# Altium project ArcadESP v1.PrjPcb
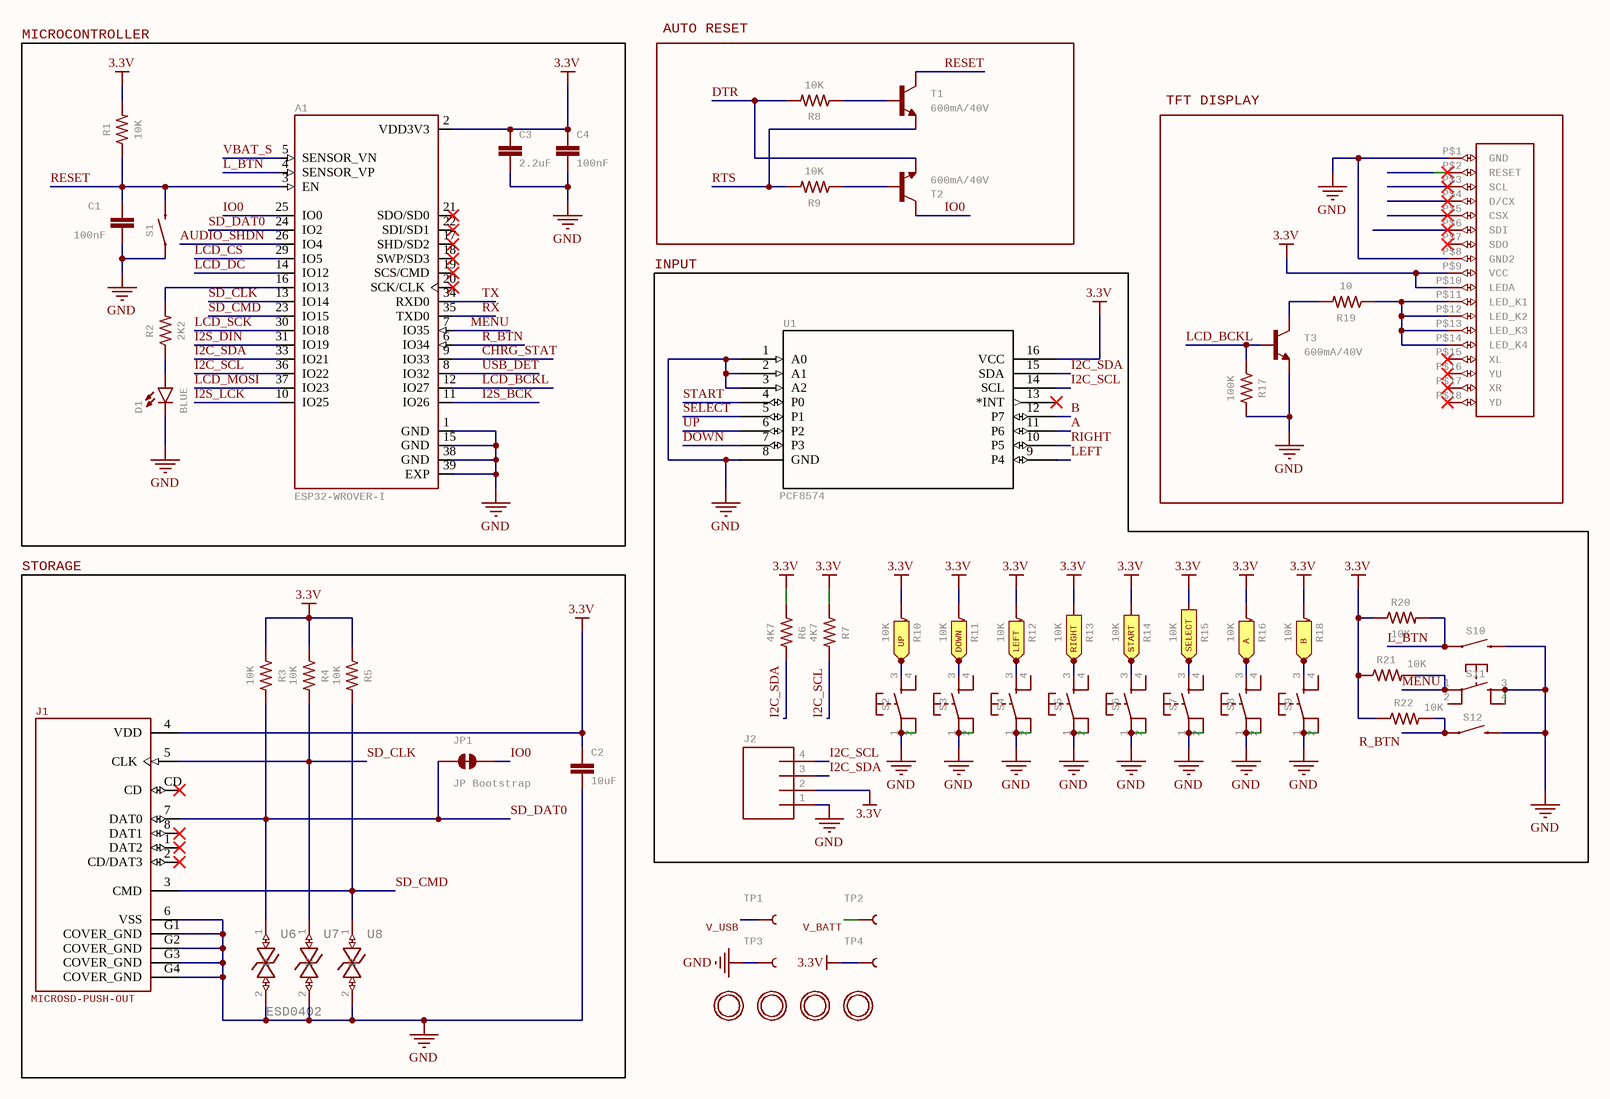
[diagram p0: Schematic_1.SchDoc]
2 sheets, 115 parts. Net scope: flat (ports and power ports of the same name join across sheets).
Board file: ArcadESP.PcbDoc
Sheets:
  Schematic_1.SchDoc
  Schematic_2.SchDoc

## Sheet Schematic_1.SchDoc
size 381 x 241 mm; SheetNumber: 1; SheetTotal: 2

### Parts
A1  ESP32-WROVER-I  [XCVR_ESP32-WROVER-I]
C1  100nF  [0805]
C2  10uF  [0805]
C3  2.2uF  [0805]
C4  100nF  [0805]
D1  BLUE  [LED-0603]
H1  (no value)  [MICROBUILDER_MOUNTINGHOLE_3.0_PLATEDTHIN]
H2  (no value)  [MICROBUILDER_MOUNTINGHOLE_3.0_PLATEDTHIN]
H3  (no value)  [MICROBUILDER_MOUNTINGHOLE_3.0_PLATEDTHIN]
H4  (no value)  [MICROBUILDER_MOUNTINGHOLE_3.0_PLATEDTHIN]
J1  MICROSD-PUSH-OUT  [MICROSD-PUSH-OUT]
J2  (no value)  [1X04_1MM_RA]
JP1  JP Bootstrap  [SMT-JUMPER_2_NC_TRACE_NO-SILK]
LCD?  ILI9341-2.4_LCD1  [ILI9341-2-4]  (value not drawn)
R1  10K  [0805]
R2  2K2  [0805]
R3  10K  [0805]
R4  10K  [0805]
R5  10K  [0805]
R6  4K7  [0805]
R7  4K7  [0805]
R8  10K  [0805]
R9  10K  [0805]
R10  10K  [0805]
R11  10K  [0805]
R12  10K  [0805]
R13  10K  [0805]
R14  10K  [0805]
R15  10K  [0805]
R16  10K  [0805]
R17  100K  [0805]
R18  10K  [0805]
R19  10  [0805]
R20  10K  [0805]
R21  10K  [0805]
R22  10K  [0805]
S1  Momentary Switch (Pushbutton) - SPST    Normally-open (NO) SPST momentary switches (buttons, pushbuttons). Variants  PTH-12MM - 12mm square, through-hole  Momentary Pushbutton Switch - 12mm Square (COM-09190)     PTH-6.0MM, PTH-6.0MM-KIT - 6.0mm square, through-hole  Mini Pushbutton Switch (COM-00097)  KIT package intended for soldering kit's - only one side of pads' copper is exposed.     PTH-RIGHT-ANGLE-KIT - Right-angle, through-hole  Right Angle Tactile Button - Used on SparkFun BigTime Watch Kit     SMD-12MM - 12mm square, surface-mount  Tactile Button - SMD (12mm) (COM-12993)  Used on SparkFun PicoBoard     SMD-4.5MM - 4.5mm Square Trackball Switch  Used on SparkFun Blackberry Trackballer Breakout     SMD-4.6MMX2.8MM -  4.60mm x 2.80mm, surface mount  Used on SparkFun SAMD21 Mini Breakout     SMD-5.2MM, SMD-5.2-REDUNDANT - 5.2mm square, surface-mount  Mini Pushbutton Switch - SMD (COM-08720)  Used on Arduino Pro Mini  REDUNDANT package connects both switch circuits together     SMD-6.0X3.5MM - 6.0 x 3.5mm, surface mount  Momentary Reset Switch SMD (COM-08229)     SMD-6.2MM-TALL - 6.2mm square, surface mount  Tactile Button - SMD (6mm)  Used on SparkFun Digital Sandbox     SMD-RIGHT-ANGLE - Right-angle, surface mount  Used on SparkFun Block for IntelÂ® Edison - Arduino  [TACTILE_SWITCH_SMD_5-2MM]  (value not drawn)
S2  MOMENTARY-SWITCH-SPST-2  [TACTILE_SWITCH_SMD_5-2MM]  (value not drawn)
S3  MOMENTARY-SWITCH-SPST-2  [TACTILE_SWITCH_SMD_5-2MM]  (value not drawn)
S4  MOMENTARY-SWITCH-SPST-2  [TACTILE_SWITCH_SMD_5-2MM]  (value not drawn)
S5  MOMENTARY-SWITCH-SPST-2  [TACTILE_SWITCH_SMD_5-2MM]  (value not drawn)
S6  MOMENTARY-SWITCH-SPST-2  [TACTILE_SWITCH_SMD_5-2MM]  (value not drawn)
S7  MOMENTARY-SWITCH-SPST-2  [TACTILE_SWITCH_SMD_5-2MM]  (value not drawn)
S8  MOMENTARY-SWITCH-SPST-2  [TACTILE_SWITCH_SMD_5-2MM]  (value not drawn)
S9  MOMENTARY-SWITCH-SPST-2  [TACTILE_SWITCH_SMD_5-2MM]  (value not drawn)
S10  Momentary Switch (Pushbutton) - SPST    Normally-open (NO) SPST momentary switches (buttons, pushbuttons). Variants  PTH-12MM - 12mm square, through-hole  Momentary Pushbutton Switch - 12mm Square (COM-09190)     PTH-6.0MM, PTH-6.0MM-KIT - 6.0mm square, through-hole  Mini Pushbutton Switch (COM-00097)  KIT package intended for soldering kit's - only one side of pads' copper is exposed.     PTH-RIGHT-ANGLE-KIT - Right-angle, through-hole  Right Angle Tactile Button - Used on SparkFun BigTime Watch Kit     SMD-12MM - 12mm square, surface-mount  Tactile Button - SMD (12mm) (COM-12993)  Used on SparkFun PicoBoard     SMD-4.5MM - 4.5mm Square Trackball Switch  Used on SparkFun Blackberry Trackballer Breakout     SMD-4.6MMX2.8MM -  4.60mm x 2.80mm, surface mount  Used on SparkFun SAMD21 Mini Breakout     SMD-5.2MM, SMD-5.2-REDUNDANT - 5.2mm square, surface-mount  Mini Pushbutton Switch - SMD (COM-08720)  Used on Arduino Pro Mini  REDUNDANT package connects both switch circuits together     SMD-6.0X3.5MM - 6.0 x 3.5mm, surface mount  Momentary Reset Switch SMD (COM-08229)     SMD-6.2MM-TALL - 6.2mm square, surface mount  Tactile Button - SMD (6mm)  Used on SparkFun Digital Sandbox     SMD-RIGHT-ANGLE - Right-angle, surface mount  Used on SparkFun Block for IntelÂ® Edison - Arduino  [TACTILE_SWITCH_PTH_RIGHT_ANGLE_KIT]  (value not drawn)
S11  MOMENTARY-SWITCH-SPST-2  [TACTILE_SWITCH_SMD_5-2MM]  (value not drawn)
S12  Momentary Switch (Pushbutton) - SPST    Normally-open (NO) SPST momentary switches (buttons, pushbuttons). Variants  PTH-12MM - 12mm square, through-hole  Momentary Pushbutton Switch - 12mm Square (COM-09190)     PTH-6.0MM, PTH-6.0MM-KIT - 6.0mm square, through-hole  Mini Pushbutton Switch (COM-00097)  KIT package intended for soldering kit's - only one side of pads' copper is exposed.     PTH-RIGHT-ANGLE-KIT - Right-angle, through-hole  Right Angle Tactile Button - Used on SparkFun BigTime Watch Kit     SMD-12MM - 12mm square, surface-mount  Tactile Button - SMD (12mm) (COM-12993)  Used on SparkFun PicoBoard     SMD-4.5MM - 4.5mm Square Trackball Switch  Used on SparkFun Blackberry Trackballer Breakout     SMD-4.6MMX2.8MM -  4.60mm x 2.80mm, surface mount  Used on SparkFun SAMD21 Mini Breakout     SMD-5.2MM, SMD-5.2-REDUNDANT - 5.2mm square, surface-mount  Mini Pushbutton Switch - SMD (COM-08720)  Used on Arduino Pro Mini  REDUNDANT package connects both switch circuits together     SMD-6.0X3.5MM - 6.0 x 3.5mm, surface mount  Momentary Reset Switch SMD (COM-08229)     SMD-6.2MM-TALL - 6.2mm square, surface mount  Tactile Button - SMD (6mm)  Used on SparkFun Digital Sandbox     SMD-RIGHT-ANGLE - Right-angle, surface mount  Used on SparkFun Block for IntelÂ® Edison - Arduino  [TACTILE_SWITCH_PTH_RIGHT_ANGLE_KIT]  (value not drawn)
T1  600mA/40V  [SOT23-3]
T2  600mA/40V  [SOT23-3]
T3  600mA/40V  [SOT23-3]
TP1  (no value)  [PAD.03X.03]
TP2  (no value)  [PAD.03X.03]
TP3  (no value)  [PAD.03X.03]
TP4  (no value)  [PAD.03X.03]
U1  PCF8574  [SO16]
U6  ESD0402  [ESD0402]
U7  ESD0402  [ESD0402]  (value not drawn)
U8  ESD0402  [ESD0402]  (value not drawn)

### Blocks framed on the sheet
MICROCONTROLLER: A1 C1 C3 C4 D1 R1 R2 S1
AUTO RESET: R8 R9 T1 T2
TFT DISPLAY: LCD? R17 R19 T3
INPUT: J2 R6 R7 R10-R16 R18 R20-R22 S2-S12 U1
STORAGE: C2 J1 JP1 R3-R5 U6-U8

### Ports
A (in), B (in), DOWN (in), LEFT (in), RIGHT (in), SELECT (in), START (in), UP (in)

### Nets
3.3V: A1.2(VDD3V3) C2.1 C3.1 C4.1 J1.4(VDD) J2.2 LCD?.P$9(VCC) LCD?.P$10(LEDA) R1.2 R3.1 R4.1 R5.1 R6.1 R7.1 R10.1 R11.1 R12.1 R13.1 R14.1 R15.1 R16.1 R18.1 R20.1 R21.1 R22.1 TP4.P$1 U1.16(VCC)
GND: A1.1(GND) A1.15(GND) A1.38(GND) A1.39(EXP) C1.2 C2.2 C3.2 C4.2 D1.C J1.6(VSS) J1.G1(COVER_GND) J1.G2(COVER_GND) J1.G3(COVER_GND) J1.G4(COVER_GND) J2.1 LCD?.P$1(GND) LCD?.P$8(GND2) R17.2 S1.1 S2.1 S2.2 S3.1 S3.2 S4.1 S4.2 S5.1 S5.2 S6.1 S6.2 S7.1 S7.2 S8.1 S8.2 S9.1 S9.2 S10.2 S11.3 S11.4 S12.2 T3.2(E) TP3.P$1 U1.1(A0) U1.2(A1) U1.3(A2) U1.8(GND) U6.2 U7.2 U8.2  [project net AUDIO_SHDN]
A: U1.11(P6)
AUDIO_SHDN: A1.26(IO4)
B: U1.12(P7)
CHRG_STAT: A1.9(IO33)
DOWN: U1.7(P3)
DTR: R8.2 T2.2(E)
I2C_SCL: A1.36(IO22) J2.4 R7.2 U1.14(SCL)
I2C_SDA: A1.33(IO21) J2.3 R6.2 U1.15(SDA)
I2S_BCK: A1.11(IO26)
I2S_DIN: A1.31(IO19)
I2S_LCK: A1.10(IO25)
IO0: A1.25(IO0) JP1.2 T2.3(C)
L_BTN: A1.4(SENSOR_VP) R20.2 S10.1
LCD_BCKL: A1.12(IO27) R17.1 T3.1(B)
LCD_CS: A1.29(IO5)
LCD_DC: A1.14(IO12)
LCD_MOSI: A1.37(IO23)
LCD_SCK: A1.30(IO18)
LEFT: U1.9(P4)
MENU: A1.7(IO35) R21.2 S11.1
R_BTN: A1.6(IO34) R22.2 S12.1
RESET: A1.3(EN) C1.1 R1.1 S1.3 T1.3(C)
RIGHT: U1.10(P5)
RTS: R9.2 T1.2(E)
RX: A1.35(TXD0)
SD_CLK: A1.13(IO14) J1.5(CLK) R4.2 U7.1
SD_CMD: A1.23(IO15) J1.3(CMD) R5.2 U8.1
SD_DAT0: A1.24(IO2) J1.7(DAT0) JP1.1 R3.2 U6.1
SELECT: U1.5(P1)
START: U1.4(P0)
TX: A1.34(RXD0)
UP: U1.6(P2)
USB_DET: A1.8(IO32)
V_BATT: TP2.P$1
V_USB: TP1.P$1
VBAT_S: A1.5(SENSOR_VN)
NetA1_16: A1.16(IO13) R2.2
NetD1_A: D1.A R2.1
NetLCD?_P$11: LCD?.P$11(LED_K1) LCD?.P$12(LED_K2) LCD?.P$13(LED_K3) LCD?.P$14(LED_K4) R19.1
NetR8_1: R8.1 T1.1(B)
NetR9_1: R9.1 T2.1(B)
NetR10_2: R10.2 S2.3 ; port UP
NetR11_2: R11.2 S3.3 ; port DOWN
NetR12_2: R12.2 S4.3 ; port LEFT
NetR13_2: R13.2 S5.3 ; port RIGHT
NetR14_2: R14.2 S6.3 ; port START
NetR15_2: R15.2 S7.3 ; port SELECT
NetR16_2: R16.2 S8.3 ; port A
NetR18_2: R18.2 S9.3 ; port B
NetR19_2: R19.2 T3.3(C)

Not connected (* = marked no-connect by the designer): A1 17(SHD/SD2)* 18(SWP/SD3)* 19(SCS/CMD)* 20(SCK/CLK)* 21(SDO/SD0)* 22(SDI/SD1)*; J1 1(DAT2)* 2(CD/DAT3)* 8(DAT1)* CD*; LCD? P$2(RESET)* P$3(SCL)* P$4(D/CX)* P$5(CSX)* P$6(SDI)* P$7(SDO)* P$15(XL)* P$16(YU)* P$17(XR)* P$18(YD)*; S2 4; S3 4; S4 4; S5 4; S6 4; S7 4; S8 4; S9 4; S11 2; U1 13(*INT)*

### Library data of the parts
A1 = ESP32-WROVER-I_A1: Module: combo; GPIO, I2C x2, I2S x2, SDIO, SPI x3, UART x3; U.FL; GateName_1: G$1; MF: Espressif Systems; SymbolName_1: ESP32-WROVER-I; LibraryName: ESP32-WROVER-I; DeviceSetName: ESP32-WROVER-I; Package: XCVR_ESP32-WROVER-I; AVAILABILITY: Unavailable; MP: ESP32-WROVER-I; PACKAGE: Module Espressif Systems; PRICE: None
C1 C2 C4 = 2.2UF-0805-25V-(+80/-20%): GateName_1: G$1; SymbolName_1: CAP; DeviceSetName: 2.2UF; PROD_ID: CAP-10009; DeviceName: -0805-25V-(+80/-20%); LibraryName: SparkFun-Capacitors; Package: 0805
C3 = 2.2UF-0805-25V-(+80/-20%): GateName_1: G$1; SymbolName_1: CAP; PROD_ID: CAP-10009; DeviceName: -0805-25V-(+80/-20%); LibraryName: SparkFun-Capacitors; DeviceSetName: 2.2UF; Package: 0805
D1 = LED-BLUE0603: GateName_1: G$1; SymbolName_1: LED; DeviceName: 0603; PROD_ID: DIO-09911; LibraryName: SparkFun-LED; DeviceSetName: LED-BLUE; Package: LED-0603
H1-H4 = Mounting Hole_H1, H2, H3, H4: MICROBUILDER_MOUNTINGHOLE3.0THIN; GateName_1: G$1; BOM: EXCLUDE; SymbolName_1: MICROBUILDER_MOUNTINGHOLE; DeviceName: 3.0THIN; LibraryName: Adafruit UDA1334 I2S DAC; DeviceSetName: MICROBUILDER_MOUNTINGHOLE; Package: MICROBUILDER_MOUNTINGHOLE_3.0_PLATEDTHIN
J1 = MICROSD-PUSH-OUT_J1: T-Flash Push-Out Micro SD Card Reader 14.75mm x 14.5mm SMD with external pins; GateName_1: G$1; SymbolName_1: MICROSD; LibraryName: microsd; DeviceSetName: MICROSD-PUSH-OUT; Package: MICROSD-PUSH-OUT
J2 = QWIIC_CONNECTORJS-1MM_J2: QWIIC_CONNECTORJS-1MM; GateName_1: G$1; SymbolName_1: I2C_STANDARD; DeviceName: JS-1MM; PROD_ID: CONN-13694; LibraryName: SparkFun-Connectors; DeviceSetName: QWIIC_CONNECTOR; Package: 1X04_1MM_RA
JP1 = JP Bootstrap_JP1: JUMPER-SMT_2_NC_TRACE_NO-SILK; GateName_1: G$1; SymbolName_1: SMT-JUMPER_2_NC_TRACE; DeviceName: _NO-SILK; LibraryName: SparkFun-Jumpers; DeviceSetName: JUMPER-SMT_2_NC_TRACE; Package: SMT-JUMPER_2_NC_TRACE_NO-SILK
LCD? = ILI9341-2.4_LCD1: GateName_1: G$1; SymbolName_1: ILI9341-2.4; LibraryName: TFTDisplays; DeviceSetName: ILI9341-2.4; Package: ILI9341-2.4
R1-R22 = 0.22OHM-0805-1/4W-1%: GateName_1: G$1; SymbolName_1: RESISTOR; PROD_ID: RES-09883; DeviceName: -0805-1/4W-1%; LibraryName: SparkFun-Resistors; DeviceSetName: 0.22OHM; Package: 0805
S1 = MOMENTARY-SWITCH-SPST-SMD-5.2MM: GateName_1: G$1; SymbolName_1: SWITCH-MOMENTARY-2; PROD_ID: COMP-12265; DeviceName: -SMD-5.2MM; LibraryName: SparkFun-Switches; DeviceSetName: MOMENTARY-SWITCH-SPST; Package: TACTILE_SWITCH_SMD_5.2MM; SF_SKU: COM-12993
S2-S9 S11 = MOMENTARY-SWITCH-SPST-2: MOMENTARY-SWITCH-SPST-2-SMD-5.2MM, S2, S3, S4, S5, S6, S7, S8, S9, S11; GateName_1: G$1; SymbolName_1: SWITCH-MOMENTARY; PROD_ID: SWCH-08247; SF_SKU: COM-08720; DeviceName: -SMD-5.2MM; LibraryName: SparkFun-Switches; DeviceSetName: MOMENTARY-SWITCH-SPST-2; Package: TACTILE_SWITCH_SMD_5.2MM
S10 S12 = MOMENTARY-SWITCH-SPST-PTH-RIGHT-ANGLE-KIT_L: MOMENTARY-SWITCH-SPST-PTH-RIGHT-ANGLE-KIT; GateName_1: G$1; SymbolName_1: SWITCH-MOMENTARY-2; PROD_ID: SWCH-09213; SF_SKU: COM-10791; DeviceName: -PTH-RIGHT-ANGLE-KIT; LibraryName: SparkFun-Switches; DeviceSetName: MOMENTARY-SWITCH-SPST; Package: TACTILE_SWITCH_PTH_RIGHT_ANGLE_KIT
T1-T3 = TRANS_NPN-MMBT2222AL: GateName_1: G$1; SymbolName_1: NPN; PROD_ID: TRANS-08049; DeviceName: -MMBT2222AL; LibraryName: SparkFun-DiscreteSemi; DeviceSetName: TRANS_NPN; Package: SOT23-3
TP1-TP4 = TEST-POINT3_TP1, TP2, TP3, TP4: PAD.03X.03; GateName_1: G$1; DeviceName: 3; SymbolName_1: TEST-POINT; LibraryName: SparkFun-Connectors; DeviceSetName: TEST-POINT; Package: PAD.03X.03
U1 = PCF8574_U1: 8 100kHz I2C SO-16-300mil I/O Expanders ROHS; GateName_1: G$1; MF: Texas Instruments; SymbolName_1: PCF8574; LibraryName: PCF8574; DeviceSetName: PCF8574; Package: SO16; AVAILABILITY: Unavailable; MP: PCF8574; PACKAGE: SOIC-16 Texas Instruments; PRICE: None
U6-U8 = ESD0402_U6, U7, U8: GateName_1: G$1; SymbolName_1: ESDM3032MXT5G; LibraryName: ESDM3032MXT5G; DeviceSetName: ESD0402; Package: ESD0402

## Sheet Schematic_2.SchDoc
size 381 x 241 mm; SheetNumber: 2; SheetTotal: 2
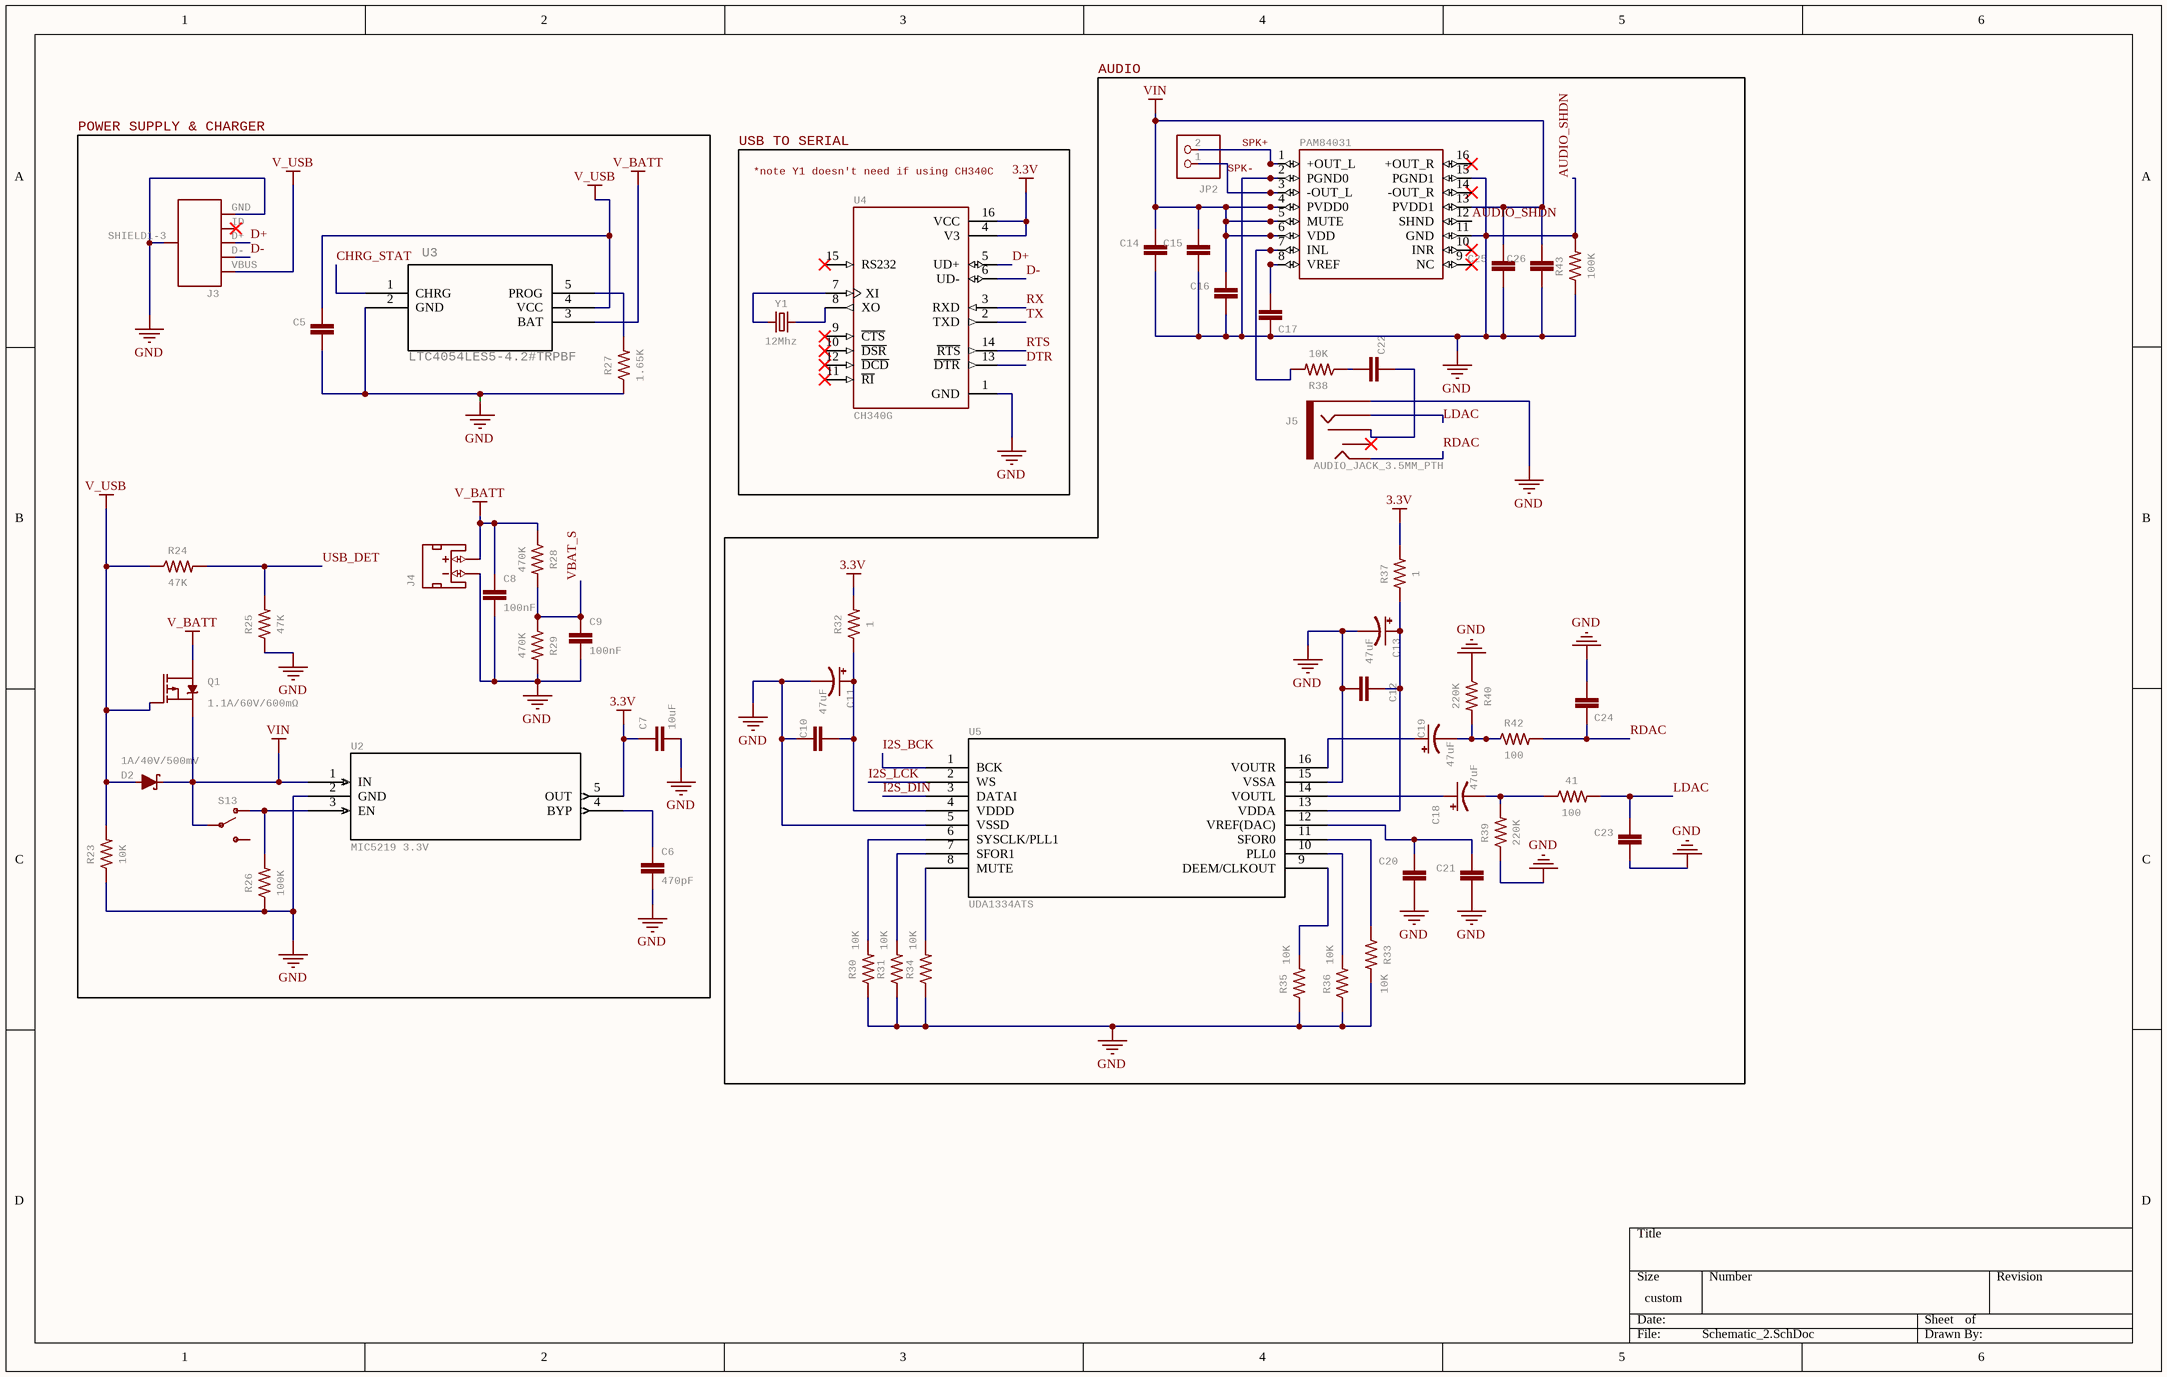
[diagram p1: Schematic_2.SchDoc]

### Parts
41  100  [0805 RESISTOR]
C5  (no value)  [0805]
C6  470pF  [0805]
C7  10uF  [0805]
C8  100nF  [0805]
C9  100nF  [0805]
C10  (no value)  [0805]
C11  47uF  [EIA3528]
C12  (no value)  [0805]
C13  47uF  [EIA3528]
C14  (no value)  [0805]
C15  (no value)  [0805]
C16  (no value)  [0805]
C17  (no value)  [0805]
C18  47uF  [EIA3528]
C19  47uF  [EIA3528]
C20  (no value)  [0805]
C21  (no value)  [0805]
C22  (no value)  [0805]
C23  (no value)  [0805]
C24  (no value)  [0805]
C25  (no value)  [0805]
C26  (no value)  [0805]
D2  1A/40V/500mV  [SMA-DIODE]
J3  (no value)  [USB-B-MICRO-SMD]
J4  (no value)  [JST-2-SMD]
J5  AUDIO_JACK_3.5MM_PTH  [AUDIO-JACK]
JP2  (no value)  [1X02M]
PAM84031  PAM8403  [SOP-16]  (value not drawn)
Q1  1.1A/60V/600mΩ  [SOT23-3]
R23  10K  [0805]
R24  47K  [0805]
R25  47K  [0805]
R26  100K  [0805]
R27  1.65K  [0805]
R28  470K  [0805]
R29  470K  [0805]
R30  10K  [0805]
R31  10K  [0805]
R32  1  [0805]
R33  10K  [0805]
R34  10K  [0805]
R35  10K  [0805]
R36  10K  [0805]
R37  1  [0805]
R38  10K  [0805]
R39  220K  [0805]
R40  220K  [0805]
R42  100  [0805]
R43  100K  [0805]
S13  (no value)  [SWITCH_SPST_SMD_A]
U2  MIC5219 3.3V  [SOT23-5]
U3  LTC4054LES5-4.2#TRPBF  [SOT95P280X100-5N]
U4  CH340G  [SO016]
U5  UDA1334ATS  [MICROBUILDER_SSOP16_4.4MM]
Y1  12Mhz  [CRYSTAL-SMD-5X3.2-4PAD]

### Blocks framed on the sheet
POWER SUPPLY & CHARGER: C5-C9 D2 J3 J4 Q1 R23-R29 S13 U2 U3
AUDIO: 41 C10-C26 J5 JP2 PAM84031 R30-R40 R42 R43 U5
USB TO SERIAL: U4 Y1

### Nets
3.3V: C7.1 R32.2 R37.2 U2.5(OUT) U4.4(V3) U4.16(VCC)
AUDIO_SHDN: C5.1 C6.2 C7.2 C8.2 C9.2 C10.1 C11.C(-) C12.1 C13.C(-) C14.1 C15.1 C16.1 C17.1 C20.1 C21.1 C23.1 C24.1 C25.1 C26.1 J3.GND J3.SHIELD1-3(SHIELD) J4.1(-) J5.SLEEVE PAM84031.2(PGND0) PAM84031.11(GND) PAM84031.12(SHND) PAM84031.15(PGND1) R23.1 R25.1 R26.1 R27.1 R29.2 R30.1 R31.1 R33.1 R34.1 R35.1 R36.1 R39.1 R40.1 R43.1 R43.2 U2.2(GND) U3.2(GND) U4.1(GND) U5.5(VSSD) U5.15(VSSA)  [also labelled GND]
V_BATT: C8.1 J4.2(+) Q1.3(D) R28.1 U3.3(BAT)
V_USB: C5.2 D2.A J3.VBUS Q1.1(G) R23.2 R24.1 U3.4(VCC)
VIN: C14.2 C15.2 C16.2 C25.2 C26.2 D2.C PAM84031.4(PVDD0) PAM84031.5(MUTE) PAM84031.6(VDD) PAM84031.13(PVDD1) Q1.2(S) S13.2(P) U2.1(IN)
CHRG_STAT: U3.1(CHRG)
D+: J3.D+ U4.5(UD+)
D-: J3.D- U4.6(UD-)
DTR: U4.13(~{DTR})
I2S_BCK: U5.1(BCK)
I2S_DIN: U5.3(DATAI)
I2S_LCK: U5.2(WS)
LDAC: 41.2 C23.2 J5.RING
RDAC: C24.2 J5.TIP R42.2
RTS: U4.14(~{RTS})
RX: U4.3(RXD)
SPK+: JP2.2 PAM84031.1(+OUT_L)
SPK-: JP2.1 PAM84031.3(-OUT_L)
TX: U4.2(TXD)
USB_DET: R24.2 R25.2
VBAT_S: C9.1 R28.2 R29.1
Net41_1: 41.1 C18.C(-) R39.2
NetC6_1: C6.1 U2.4(BYP)
NetC10_2: C10.2 C11.A(+) R32.1 U5.4(VDDD)
NetC12_2: C12.2 C13.A(+) R37.1 U5.13(VDDA)
NetC17_2: C17.2 PAM84031.8(VREF)
NetC18_A: C18.A(+) U5.14(VOUTL)
NetC19_A: C19.A(+) U5.16(VOUTR)
NetC19_C: C19.C(-) R40.2 R42.1
NetC20_2: C20.2 C21.2 U5.12(VREF(DAC))
NetC22_1: C22.1 R38.1
NetC22_2: C22.2 J5.RSH
NetPAM84031_7: PAM84031.7(INL) R38.2
NetR26_2: R26.2 S13.1(O) U2.3(EN)
NetR27_2: R27.2 U3.5(PROG)
NetR30_2: R30.2 U5.6(SYSCLK/PLL1)
NetR31_2: R31.2 U5.7(SFOR1)
NetR33_2: R33.2 U5.11(SFOR0)
NetR34_2: R34.2 U5.8(MUTE)
NetR35_2: R35.2 U5.9(DEEM/CLKOUT)
NetR36_2: R36.2 U5.10(PLL0)
NetU4_7: U4.7(XI) Y1.3
NetU4_8: U4.8(XO) Y1.1

Not connected (* = marked no-connect by the designer): J3 ID*; J4 NC1(PAD1) NC2(PAD2); J5 TSH*; PAM84031 9(NC)* 10(INR)* 14(-OUT_R)* 16(+OUT_R)*; S13 3(S); U4 9(~{CTS})* 10(~{DSR})* 11(~{RI})* 12(~{DCD})* 15(RS232)*

### Notes on the sheet
- (near U4) *note Y1 doesn't need if using CH340C

### Library data of the parts
41 R27 R30-R40 R42 R43 = 0.3OHM-0805-1/8W-1%: GateName_1: G$1; SymbolName_1: RESISTOR; DeviceSetName: 0.3OHM; PROD_ID: RES-11622; DeviceName: -0805-1/8W-1%; LibraryName: SparkFun-Resistors; Package: 0805
C5-C10 C12 C14-C17 C20-C26 = 2.2UF-0805-25V-(+80/-20%): as C1 on sheet Schematic_1; DeviceName: -0805-25V-(+80/-20%); LibraryName: SparkFun-Capacitors; Package: 0805
C11 C13 C18 C19 = 47UF-POLAR-EIA3528-10V-10%: GateName_1: G$1; SymbolName_1: CAP_POL; PROD_ID: CAP-08478; DeviceName: -EIA3528-10V-10%; LibraryName: SparkFun-Capacitors; DeviceSetName: 47UF-POLAR; Package: EIA3528
D2 = DIODE-SCHOTTKY-SS14: GateName_1: G$1; DeviceName: -SS14; PROD_ID: DIO-08053; SymbolName_1: DIODE-SCHOTTKY; LibraryName: SparkFun-DiscreteSemi; DeviceSetName: DIODE-SCHOTTKY; Package: SMA-DIODE
J3 = USB_MICRO-B_FEMALE-SMT_J3: GateName_1: G$1; SymbolName_1: USB-5PIN; PROD_ID: CONN-09505; SF_ID: PRT-08533; DeviceName: _FEMALE-SMT; LibraryName: SparkFun-Connectors; DeviceSetName: USB_MICRO-B; Package: USB-B-MICRO-SMD
J4 = JST_2MM_MALE_J4: JST_2MM_MALE; GateName_1: G$1; PROD_ID: CONN-11443; SF_ID: PRT-08612; SymbolName_1: JST_2MM_MALE; LibraryName: SparkFun-Connectors; DeviceSetName: JST_2MM_MALE; Package: JST-2-SMD
J5 = AUDIO_JACK_3.5MM_PTH_J5: GateName_1: G$1; SymbolName_1: AUDIO-JACK2; DeviceName: _PTH; PROD_ID: CONN-10353; SF_ID: PRT-08032; LibraryName: SparkFun-Connectors; DeviceSetName: AUDIO_JACK_3.5MM; Package: AUDIO-JACK
JP2 = PINHD-1X2_2.00_JP2: PINHD-1X2_2.00; GateName_1: G$1; SymbolName_1: PINHD2; DeviceName: _2.00; LibraryName: pinhead-1; DeviceSetName: PINHD-1X2; Package: 1X02M
PAM84031 = PAM8403_YES: Dual channel audio amplifier IC - PAM8403; GateName_1: G$1; SymbolName_1: PAM8403; LibraryName: PAM8403; DeviceSetName: PAM8403; Package: SOP-16
Q1 = MOSFET_PCH-SI2309DS: GateName_1: G$1; SymbolName_1: LABELED-PMOS; PROD_ID: TRANS-08285; DeviceName: -SI2309DS; LibraryName: SparkFun-DiscreteSemi; DeviceSetName: MOSFET_PCH; Package: SOT23-3
R23-R26 R28 R29 = 0.22OHM-0805-1/4W-1%: as R1 on sheet Schematic_1; DeviceName: -0805-1/4W-1%; LibraryName: SparkFun-Resistors; DeviceSetName: 0.22OHM; Package: 0805
S13 = SWITCH-SPDT-SMD-RIGHT-ANGLE_1: GateName_1: 1; SymbolName_1: TOGGLE; PROD_ID: SWCH-10651; SF_ID: COM-00597; SF_SKU: COM-10860; DeviceName: -SMD-RIGHT-ANGLE; LibraryName: SparkFun-Switches; DeviceSetName: SWITCH-SPDT; Package: SWITCH_SPST_SMD_A
U2 = V_REG_MIC52195V: GateName_1: G$1; SymbolName_1: V-REG-LDO; DeviceName: 5V; PROD_ID: VREG-10107; LibraryName: SparkFun-IC-Power; DeviceSetName: V_REG_MIC5219; Package: SOT23-5
U3 = LTC4054LES5-4.2#TRPBF_U3: LTC4054LES5-4.2#TRPBF*?; GateName_1: A; MF: Linear Technology/Analog; SymbolName_1: LTC4054LES5-4.2#TRPBF; LibraryName: LTC4054LES5-4.2_TRPBF; DeviceSetName: LTC4054LES5-4.2#TRPBF*?; Package: SOT95P280X100-5N; DIGI-KEY_PART_NUMBER: LTC4054LES5-4.2#TRPBFCT-ND; DIGI-KEY_PURCHASE_URL: https://www.digikey.co.id/product-detail/en/linear-technology-analog-devices/LTC4054LES5-4.2-TRPBF/LTC4054LES5-4.2-TRPBFCT-ND/1888452?utm_source=snapeda&utm_medium=aggregator&utm_campaign=symbol; MP: LTC4054LES5-4.2#TRPBF; PACKAGE: SOT-23-5 Linear Technology
U4 = CH340GSMD_U4: CH340GSMD_SO016; GateName_1: U1; DeviceName: SMD; PROD_ID: IC-13498; SymbolName_1: CH340G; LibraryName: SparkFun-IC-Comms; DeviceSetName: CH340G; Package: SO016
U5 = UDA1334_U5: MICROBUILDER_AUDIO_I2S_UDA1334""; GateName_1: G$1; SymbolName_1: MICROBUILDER_UDA1334; DeviceName: ""; LibraryName: Adafruit UDA1334 I2S DAC; DeviceSetName: MICROBUILDER_AUDIO_I2S_UDA1334; Package: MICROBUILDER_SSOP16_4.4MM
Y1 = CRYSTALSMD_Y1: CRYSTALSMD-5X3.2-4PAD; GateName_1: G$1; SymbolName_1: CRYSTAL; DeviceName: SMD-5X3.2-4PAD; LibraryName: SparkFun-Clocks; DeviceSetName: CRYSTAL; Package: CRYSTAL-SMD-5X3.2-4PAD

## Nets that join several sheets
3.3V: Schematic_1 (27 pins), Schematic_2 (6 pins)
AUDIO_SHDN: Schematic_1 (48 pins), Schematic_2 (47 pins)